# Altium schematic sheet SCH.SchDoc
size A4; SheetNumber: 1; SheetTotal: 1; SPICEModelCacheCJYMIXTO: <root> / <DocumentId>CJYMIXTO</DocumentId> / <CacheFrame Number="0"> / <Model Name="npn" Kind="MDL"> / <Text>*Default NPN BJT / *NPN Trans Pinout: C,B,E / .MODEL NPN NPN()</Text> / </Model> / <Model Name="1n4148" Kind="MDL"> / <Text>.model 1N4148  D(Is=0.1p Rs=16 CJO=2p Tt=12n Bv=100 Ibv=0.1p)</Text> / </Model> / </CacheFrame> / </root>
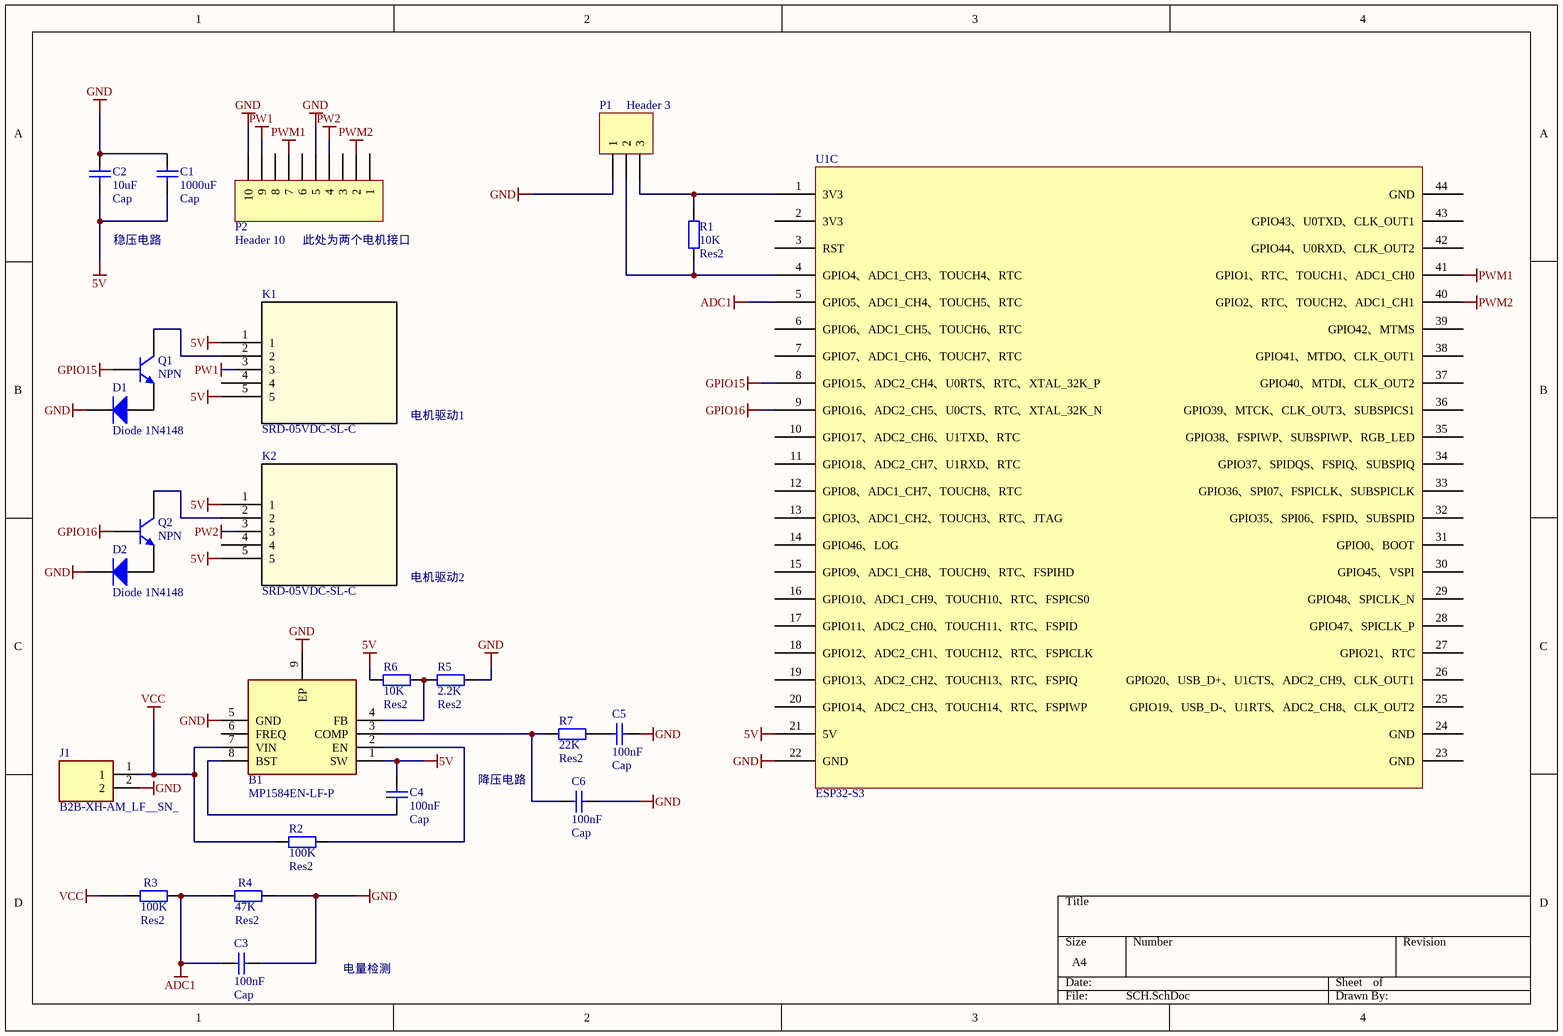
[diagram p0: SCH.SchDoc]

## Parts
B1  MP1584EN-LF-P  [SOIC127P600X170-9N]
C1  Cap  value 1000uF  [C0805]
C2  Cap  value 10uF  [C0805]
C3  Cap  value 100nF  [C0805]
C4  Cap  value 100nF  [C0805]
C5  Cap  value 100nF  [C0805]
C6  Cap  value 100nF  [C0805]
D1  Diode 1N4148  [DO-35]
D2  Diode 1N4148  [DO-35]
J1  B2B-XH-AM_LF__SN_  [B2BXHAMLFSN]
K1  SRD-05VDC-SL-C  [RELAY_SRD-05VDC-SL-C_MCE]
K2  SRD-05VDC-SL-C  [RELAY_SRD-05VDC-SL-C_MCE]
P1  Header 3  [HDR1X3]
P2  Header 10  [HDR1X10]
Q1  NPN  [TO-226-AA]
Q2  NPN  [TO-226-AA]
R1  Res2  value 10K  [C0805]
R2  Res2  value 100K  [C0805]
R3  Res2  value 100K  [C0805]
R4  Res2  value 47K  [C0805]
R5  Res2  value 2.2K  [C0805]
R6  Res2  value 10K  [C0805]
R7  Res2  value 22K  [C0805]
U1  ESP32-S3  [ESP32-S3]  (part C of 3)

## Nets
5V: B1.1(SW) C1.1 C2.1 C4.1 K1.1 K1.5 K2.1 K2.5 R6.2 U1.21(5V)
ADC1: C3.2 R3.2 R4.1 U1.5(GPIO5、ADC1_CH4、TOUCH5、RTC)
GND: B1.5(GND) B1.9(EP) C1.2 C2.2 C3.1 C5.1 C6.1 D1.2(K) D2.2(K) J1.2 P1.1 P2.5 P2.10 R4.2 R5.2 U1.22(GND)
GPIO15: Q1.2(B) U1.8(GPIO15、ADC2_CH4、U0RTS、RTC、XTAL_32K_P)
GPIO16: Q2.2(B) U1.9(GPIO16、ADC2_CH5、U0CTS、RTC、XTAL_32K_N)
PW1: K1.3 P2.9
PW2: K2.3 P2.4
PWM1: P2.7 U1.41(GPIO1、RTC、TOUCH1、ADC1_CH0)
PWM2: P2.2 U1.40(GPIO2、RTC、TOUCH2、ADC1_CH1)
VCC: B1.7(VIN) J1.1 R2.1 R3.1
NetB1_2: B1.2(EN) R2.2
NetB1_3: B1.3(COMP) C6.2 R7.2
NetB1_4: B1.4(FB) R5.1 R6.1
NetB1_8: B1.8(BST) C4.2
NetC5_2: C5.2 R7.1
NetD1_1: D1.1(A) Q1.3(E)
NetD2_1: D2.1(A) Q2.3(E)
NetK1_2: K1.2 Q1.1(C)
NetK2_2: K2.2 Q2.1(C)
NetP1_2: P1.2 R1.2 U1.4(GPIO4、ADC1_CH3、TOUCH4、RTC)
NetP1_3: P1.3 R1.1 U1.1(3V3)

Not connected (* = marked no-connect by the designer): B1 6(FREQ); K1 4; K2 4; P2 1 3 6 8; U1 2(3V3) 3(RST) 6(GPIO6、ADC1_CH5、TOUCH6、RTC) 7(GPIO7、ADC1_CH6、TOUCH7、RTC) 10(GPIO17、ADC2_CH6、U1TXD、RTC) 11(GPIO18、ADC2_CH7、U1RXD、RTC) 12(GPIO8、ADC1_CH7、TOUCH8、RTC) 13(GPIO3、ADC1_CH2、TOUCH3、RTC、JTAG) 14(GPIO46、LOG) 15(GPIO9、ADC1_CH8、TOUCH9、RTC、FSPIHD) 16(GPIO10、ADC1_CH9、TOUCH10、RTC、FSPICS0) 17(GPIO11、ADC2_CH0、TOUCH11、RTC、FSPID) 18(GPIO12、ADC2_CH1、TOUCH12、RTC、FSPICLK) 19(GPIO13、ADC2_CH2、TOUCH13、RTC、FSPIQ) 20(GPIO14、ADC2_CH3、TOUCH14、RTC、FSPIWP) 23(GND) 24(GND) 25(GPIO19、USB_D-、U1RTS、ADC2_CH8、CLK_OUT2) 26(GPIO20、USB_D+、U1CTS、ADC2_CH9、CLK_OUT1) 27(GPIO21、RTC) 28(GPIO47、SPICLK_P) 29(GPIO48、SPICLK_N) 30(GPIO45、VSPI) 31(GPIO0、BOOT) 32(GPIO35、SPI06、FSPID、SUBSPID) 33(GPIO36、SPI07、FSPICLK、SUBSPICLK) 34(GPIO37、SPIDQS、FSPIQ、SUBSPIQ) 35(GPIO38、FSPIWP、SUBSPIWP、RGB_LED) 36(GPIO39、MTCK、CLK_OUT3、SUBSPICS1) 37(GPIO40、MTDI、CLK_OUT2) 38(GPIO41、MTDO、CLK_OUT1) 39(GPIO42、MTMS) 42(GPIO44、U0RXD、CLK_OUT2) 43(GPIO43、U0TXD、CLK_OUT1) 44(GND)

## Notes on the sheet
- 稳压电路
- 此处为两个电机接口
- 电机驱动1
- 电机驱动2
- 降压电路
- 电量检测

## Library data of the parts
B1 = MP1584EN-LF-P: Switching Voltage Regulators NRFND: USE MP2338 as replacement; Manufacturer_Name: Monolithic Power Systems (MPS); Geometry.Height: 1.7mm; Manufacturer_Part_Number: MP1584EN-LF-P; Mouser Part Number: 946-MP1584EN-LF-P; Mouser Price/Stock: https://www.mouser.co.uk/ProductDetail/Monolithic-Power-Systems-MPS/MP1584EN-LF-P?qs=%252B6g0mu59x7Ie1GinT4nULQ%3D%3D; Arrow Part Number: *; Arrow Price/Stock: *; Datasheet Link: https://componentsearchengine.com/Datasheets/1/MP1584EN-LF-P.pdf
C1-C6 = Cap: Capacitor; Published: 8-Jun-2000; LatestRevisionDate: 17-Jul-2002; LatestRevisionNote: Re-released for DXP Platform.; PackageReference: RAD-0.3; Publisher: Altium Limited; PackageDescription: Radial Cap, Thru-Hole; 2 Leads; 0.3 in Pin Spacing
D1 D2 = Diode 1N4148: High Conductance Fast Diode; Published: 8-Jun-2000; LatestRevisionDate: 17-Jul-2002; LatestRevisionNote: Re-released for DXP Platform.; DatasheetVersion: 1997; PackageReference: DO-35; Publisher: Altium Limited; PackageDescription: Diode, Axial; Body 3.8 x 1.9 mm (LxDia. max), Lead Dia. 0.53 mm (max); Code_JEDEC: DO-204-AH; ComponentLink1Description: Manufacturer Link; ComponentLink1URL: http://www.fairchildsemi.com/; ComponentLink2Description: Datasheet; ComponentLink2URL: http://www.fairchildsemi.com/ds/1N%2F1N4148.pdf
J1 = B2B-XH-AM_LF__SN_: CONN HEADER VERT 2POS 2.5MM; Manufacturer_Name: JST (JAPAN SOLDERLESS TERMINALS); Manufacturer_Part_Number: B2B-XH-AM(LF)(SN); Geometry.Height: 7mm; Mouser Part Number: 306-B2B-XH-AMLFSNP; Mouser Price/Stock: https://www.mouser.co.uk/ProductDetail/JST-Commercial/B2B-XH-AMLFSN?qs=cdbOS8ANM9BJgHgwB7WxQw%3D%3D; Arrow Part Number: B2B-XH-AM(LF)(SN); Arrow Price/Stock: https://www.arrow.com/en/products/b2b-xh-am-lf-sn/jst-manufacturing?utm_currency=USD&region=europe; Datasheet Link: https://www.jst-mfg.com/product/pdf/eng/eXH.pdf
K1 K2 = SRD-05VDC-SL-C: Description; Manufacturer_Name: MCM Electronics; Copyright: Copyright (C) 2026 Ultra Librarian. All rights reserved.; Manufacturer_Part_Number: SRD-05VDC-SL-C; RefDes: RefDes; Type: Type
P1 = Header 3: Header, 3-Pin; LatestRevisionDate: 17-Jul-2002; LatestRevisionNote: Re-released for DXP Platform.; Publisher: Altium Limited
P2 = Header 10: Header, 10-Pin; LatestRevisionDate: 17-Jul-2002; LatestRevisionNote: Re-released for DXP Platform.; Publisher: Altium Limited
Q1 Q2 = NPN: NPN Bipolar Transistor; Published: 8-Jun-2000; LatestRevisionDate: 17-Jul-2002; LatestRevisionNote: Re-released for DXP Platform.; PackageReference: TO-226-AA; Publisher: Altium Limited; PackageDescription: TO, Flat Index; 3 In-Line, Axial Leads; Body Dia. 4.8mm; Leads 0.55 x 0.51 mm (max); Code_JEDEC: TO-226-AA
R1-R7 = Res2: Resistor; Published: 8-Jun-2000; LatestRevisionDate: 17-Jul-2002; LatestRevisionNote: Re-released for DXP Platform.; PackageReference: AXIAL-0.4; Publisher: Altium Limited; PackageDescription: Axial Device, Thru-Hole; 2 Leads; 0.4 in Pin Spacing